# EAGLE schematic 4_Com_E_Sem_i2c (EAGLE 9.6.2)
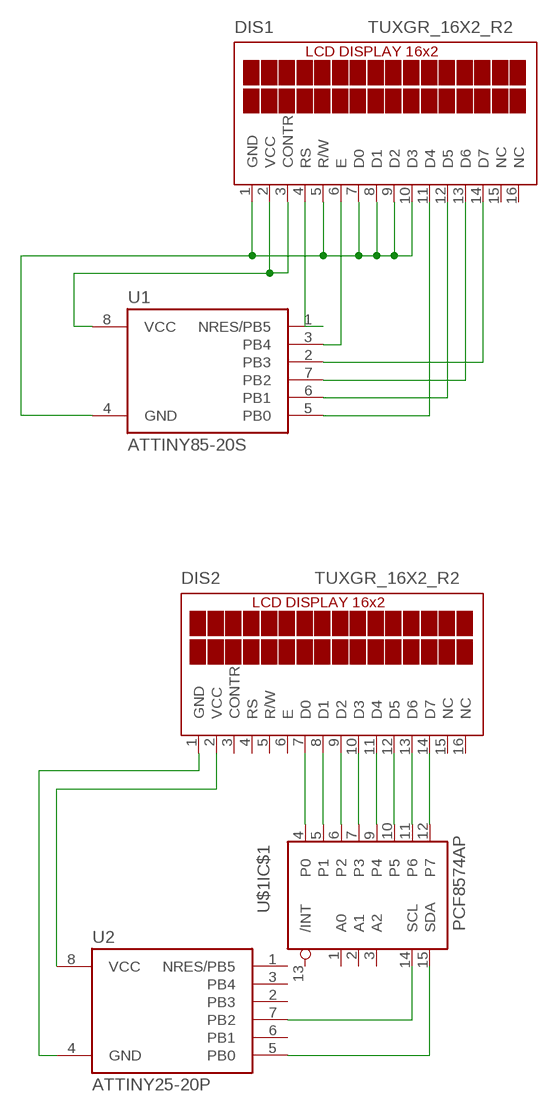
[diagram p0: schematic, sheet 1]

## Parts
DIS1  TUXGR_16X2_R2  [TUXGR_16X2_R2]
DIS2  TUXGR_16X2_R2  [TUXGR_16X2_R2]
U1  ATTINY85-20S  [SOIC8_EIAJ_208MIL]
U2  ATTINY25-20P  [PDIP08_300MIL]
U$1  PCF8574AP  [DIL16]

## Nets
N$1: DIS1.11(D4) U1.5(PB0)
N$2: DIS1.12(D5) U1.6(PB1)
N$3: DIS1.13(D6) U1.7(PB2)
N$4: DIS1.14(D7) U1.2(PB3)
N$5: DIS1.6(E) U1.3(PB4)
N$6: DIS1.4(RS) U1.1(NRES/PB5)
N$7: DIS1.2(VCC) DIS1.3(CONTR) U1.8(VCC)
N$8: DIS1.1(GND) DIS1.5(R/W) DIS1.7(D0) DIS1.8(D1) DIS1.9(D2) DIS1.10(D3) U1.4(GND)
N$9: DIS2.7(D0) U$1.4(IC$1:P0)
N$10: DIS2.8(D1) U$1.5(IC$1:P1)
N$11: DIS2.9(D2) U$1.6(IC$1:P2)
N$12: DIS2.10(D3) U$1.7(IC$1:P3)
N$13: DIS2.11(D4) U$1.9(IC$1:P4)
N$14: DIS2.12(D5) U$1.10(IC$1:P5)
N$15: DIS2.13(D6) U$1.11(IC$1:P6)
N$16: DIS2.14(D7) U$1.12(IC$1:P7)
N$17: DIS2.2(VCC) U2.8(VCC)
N$18: DIS2.1(GND) U2.4(GND)
N$19: U2.7(PB2) U$1.14(IC$1:SCL)
N$20: U2.5(PB0) U$1.15(IC$1:SDA)
Unconnected: DIS1.15(NC) DIS1.16(NC) DIS2.3(CONTR) DIS2.4(RS) DIS2.5(R/W) DIS2.6(E) DIS2.15(NC) DIS2.16(NC) U2.1(NRES/PB5) U2.2(PB3) U2.3(PB4) U2.6(PB1) U$1.1(IC$1:A0) U$1.2(IC$1:A1) U$1.3(IC$1:A2) U$1.13(IC$1:/INT)

## Power pins joined to a net without a drawn wire
GND: U$1.8(PWR:GND)
VCC: U$1.16(PWR:VCC)

## Library data of the parts
DIS1 DIS2 = display-lcd:TUXGR_16X2_R2: Tuxgraphics LCD display 16x2 characters reflective, without background light Source: tuxgr_12x2_r2.pdf; OC_FARNELL: unknown; OC_NEWARK: unknown
U1 = _hhn_attiny25_45_85:ATTINY85*: ATMEL ATtiny 85 Packages: P = PDIP 08 30mil S = SOIC 08 EIAJ 208mil Technologies Note: for complete ordering code (temp. range, finish, tape&reel etc.) see www.atmel.com • Supply Voltage: V = (1.8…5.5)V | [blank] = (2.7…5.5)V • Speed: 10 = 10 MHz | 20 = 20 MHz Author: Dipl.-Ing. FH Rainer Bayer HHN Hochschule Heilbronn (Heilbronn University), rainer.bayer@hs-heilbronn.de Ingenieurbüro ing-rb, mail@ing-rb.de
U2 = _hhn_attiny25_45_85:ATTINY25*: ATMEL ATtiny 25 Packages: P = PDIP 08 30mil S = SOIC 08 EIAJ 208mil SS = SOIC 08 JEDEC 150mil Technologies Note: for complete ordering code (temp. range, finish, tape&reel etc.) see www.atmel.com • Supply Voltage: V = (1.8…5.5)V | [blank] = (2.7…5.5)V • Speed: 10 = 10 MHz | 20 = 20 MHz Author: Dipl.-Ing. FH Rainer Bayer HHN Hochschule Heilbronn (Heilbronn University), rainer.bayer@hs-heilbronn.de Ingenieurbüro ing-rb, mail@ing-rb.de
U$1 = i2c:PCF8574: Remote 8-Bit I/O Expander for I²C Bus